# EAGLE design LedStrip Adapter (EAGLE 9.0.1)
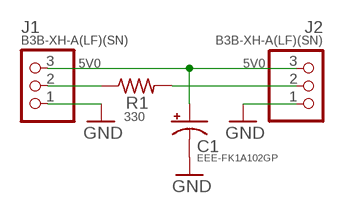
[diagram p0: schematic, sheet 1]

## Parts
C1  EEE-FK1A102GP  EEE-FC1H470P  [PANASONIC_CAP_G]
J1  B3B-XH-A(LF)(SN)  [B3B-XH-A(LF)(SN)]
J2  B3B-XH-A(LF)(SN)  [B3B-XH-A(LF)(SN)]
R1  330  R0603  [0603]

## Nets
5V0: C1.POS(+) J1.3 J2.3
GND: C1.NEG(-) J1.1 J2.1
N$1: J1.2 R1.1
N$2: J2.2 R1.2

## Library data of the parts
C1 = LedStrip Adapter:EEE-FC1H470P
J1 J2 = LedStrip Adapter:B3B-XH-A(LF)(SN)
R1 = LedStrip Adapter:R0603

## Board
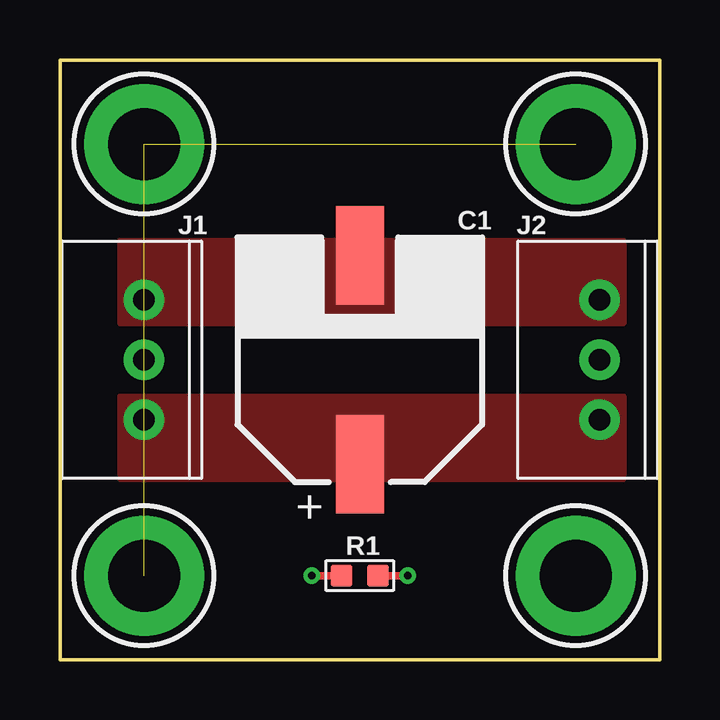
[diagram p1: board, top side]
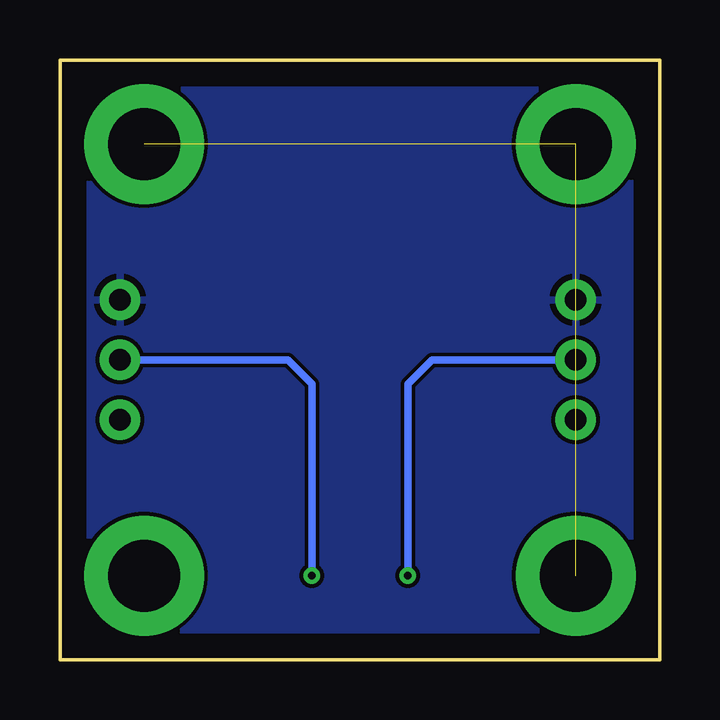
[diagram p2: board, bottom side, seen from below]

Size 25 x 25 mm. Coordinates in mm from the lower left corner, seen from the top.
Outline: 0,0 25,0 25,25 0,25 0,0
Copper layers (1*16): Top 0.035mm / dielectric 1.5mm / Bottom 0.035mm
Design rules "SeeedStudio_2layer_DRU_no_angle_20140221 *": minimum track width 6mil, minimum drill 0.3mm, track to track 6mil, track to pad 6mil, pad to pad 6mil, via to via 6mil, smd to smd 0mil, copper to edge 40mil, drill to drill 6mil, minimum pad ring 10mil, minimum via ring 8mil, stop-mask expansion 4mil, vias tented up to drill 0.7mm, thermal gap 10mil

### Footprints (pad centres in the part's own frame; a part is rotated, then mirrored left to right if it is on the bottom)
PANASONIC_CAP_G = smd 2 x 4.1: NEG 0,4.35; POS 0,-4.35
B3B-XH-A(LF)(SN) = drill 0.9 pad 1.7: 1 2.5,0; 2 0,0; 3 -2.5,0
0603 = smd 0.889 x 0.889: 1 0.762,0; 2 -0.762,0

### Placement (x,y rotation side)
C1  12.5,12.5 0 top
J1  3.5,12.5 90 top
J2  22.5,12.5 90 top
R1  12.5,3.5 180 top

### Tracks (layer width: path | path; a pad name or v marks a point on that pad's centre or on a via)
5V0
  pour Top (no thermals): 2.5,11 23.5,11 23.5,7.5 2.5,7.5
GND
  pour Top (no thermals): 23.5,14 2.5,14 2.5,17.5 23.5,17.5
  pour Bottom: 0,0 25,0 25,25 0,25
N$1  (via drill 0.3)
  Top 0.305: R1.1 v10.5,3.5
  Bottom 0.305: v10.5,3.5 10.5,11.5 9.5,12.5 J1.2
N$2  (via drill 0.3)
  Top 0.305: R1.2 v14.5,3.5
  Bottom 0.305: v14.5,3.5 14.5,11.5 15.5,12.5 J2.2
N$3  (via drill 3 pad 5)  (2 unrouted)
  other vias: 3.5,3.5 3.5,21.5 21.5,21.5
N$4  (via drill 3 pad 5)
  other vias: 21.5,3.5